# EAGLE design Rov3 - zasilanie silniki v4 (EAGLE 9.4.2)
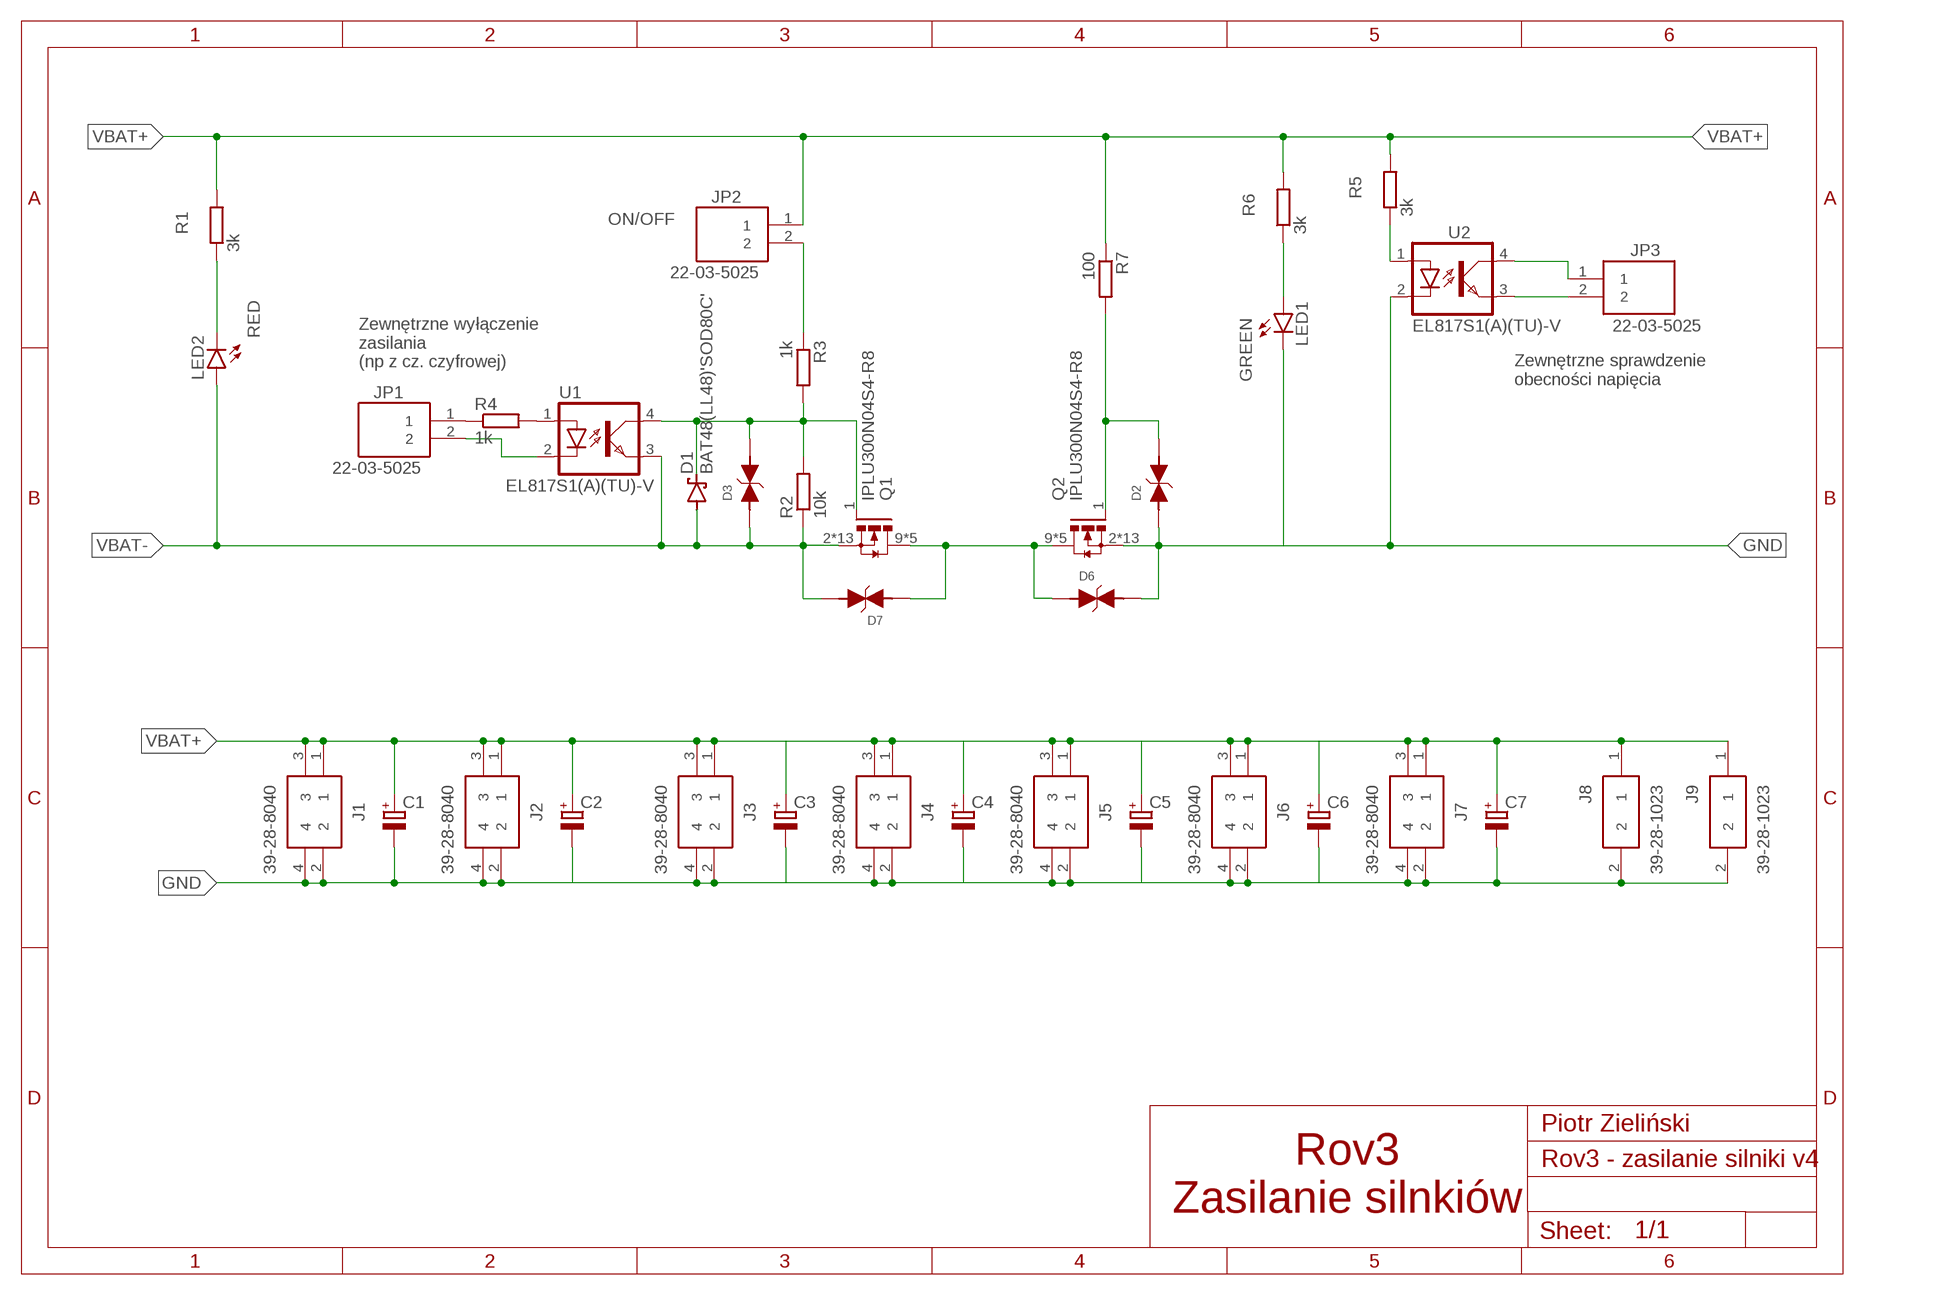
[diagram p0: schematic, sheet 1]

## Parts
C1  CPOL-EUE5-10.5  [E5-10,5]
C2  CPOL-EUE5-10.5  [E5-10,5]
C3  CPOL-EUE5-10.5  [E5-10,5]
C4  CPOL-EUE5-10.5  [E5-10,5]
C5  CPOL-EUE5-10.5  [E5-10,5]
C6  CPOL-EUE5-10.5  [E5-10,5]
C7  CPOL-EUE5-10.5  [E5-10,5]
D1  BAT48(LL48)'SOD80C'  [SOD80C]
D2  P6SMB20A_824501101  [VARTVSP_SMA/DO-214AC]
D3  P6SMB20A_824501101  [VARTVSP_SMA/DO-214AC]
D6  P6SMB20A_824501101  [VARTVSP_SMA/DO-214AC]
D7  P6SMB20A_824501101  [VARTVSP_SMA/DO-214AC]
J1  39-28-8040  [MOLEX_2X2_PCB_SOCKET]
J2  39-28-8040  [MOLEX_2X2_PCB_SOCKET]
J3  39-28-8040  [MOLEX_2X2_PCB_SOCKET]
J4  39-28-8040  [MOLEX_2X2_PCB_SOCKET]
J5  39-28-8040  [MOLEX_2X2_PCB_SOCKET]
J6  39-28-8040  [MOLEX_2X2_PCB_SOCKET]
J7  39-28-8040  [MOLEX_2X2_PCB_SOCKET]
J8  39-28-1023  [MOLEX_1X2_PCB_SOCKET]
J9  39-28-1023  [MOLEX_1X2_PCB_SOCKET]
JP1  22-03-5025  [2.50MM_MINI-SPOX_2PIN_PCB_SOCKET]
JP2  22-03-5025  [2.50MM_MINI-SPOX_2PIN_PCB_SOCKET]
JP3  22-03-5025  [2.50MM_MINI-SPOX_2PIN_PCB_SOCKET]
LED1  GREEN  LEDCHIP-LED0805  [CHIP-LED0805]
LED2  RED  LEDCHIP-LED0805  [CHIP-LED0805]
Q1  IPLU300N04S4-R8  [PG-HSOF-8-1]
Q2  IPLU300N04S4-R8  [PG-HSOF-8-1]
R1  3k  R-EU_R1206  [R1206]
R2  10k  R-EU_R1206  [R1206]
R3  1k  R-EU_R1206  [R1206]
R4  1k  R-EU_R1206  [R1206]
R5  3k  R-EU_R1206  [R1206]
R6  3k  R-EU_R1206  [R1206]
R7  100  R-EU_R1206  [R1206]
U1  EL817S1(A)(TU)-V  [SOIC254P1030X390-4N_EL817S1(A)(TU)-V]
U2  EL817S1(A)(TU)-V  [SOIC254P1030X390-4N_EL817S1(A)(TU)-V]

## Nets
GND: C1.- C2.- C3.- C4.- C5.- C6.- C7.- D2.1 D6.2 J1.2 J1.4 J2.2 J2.4 J3.2 J3.4 J4.2 J4.4 J5.2 J5.4 J6.2 J6.4 J7.2 J7.4 J8.2 J9.2 LED1.C Q2.2(S) Q2.3(S) Q2.4(S) Q2.5(S) Q2.6(S) Q2.7(S) Q2.8(S) Q2.10(S) Q2.11(S) Q2.12(S) Q2.13(S) Q2.14(S) Q2.15(S) U2.2(C)
N$1 [signal]: LED1.A R6.1
N$2: D6.1 D7.1 Q1.9(D) Q1.16(D) Q1.17(D) Q1.18(D) Q1.19(D) Q2.9(D) Q2.16(D) Q2.17(D) Q2.18(D) Q2.19(D)
N$3 [signal]: JP1.1 R4.1
N$4 [signal]: D1.C D3.2 Q1.1(G) R2.2 R3.2 U1.4(COL)
N$5 [signal]: JP1.2 U1.2(C)
N$6 [signal]: R4.2 U1.1(A)
N$7 [signal]: JP2.2 R3.1
N$8 [signal]: JP3.2 U2.3(EMIT)
N$9 [signal]: JP3.1 U2.4(COL)
N$10 [signal]: R5.1 U2.1(A)
N$11: LED2.C R1.1
N$15 [signal]: D2.2 Q2.1(G) R7.2
VBAT+: C1.+ C2.+ C3.+ C4.+ C5.+ C6.+ C7.+ J1.1 J1.3 J2.1 J2.3 J3.1 J3.3 J4.1 J4.3 J5.1 J5.3 J6.1 J6.3 J7.1 J7.3 J8.1 J9.1 JP2.1 R1.2 R5.2 R6.2 R7.1
VBAT-: D1.A D3.1 D7.2 LED2.A Q1.2(S) Q1.3(S) Q1.4(S) Q1.5(S) Q1.6(S) Q1.7(S) Q1.8(S) Q1.10(S) Q1.11(S) Q1.12(S) Q1.13(S) Q1.14(S) Q1.15(S) R2.1 U1.3(EMIT)

## Notes on the sheet
- ON/OFF
- Zewnętrzne wyłączenie
  zasilania
  (np z cz. czyfrowej)
- Zewnętrzne sprawdzenie 
  obecności napięcia
- Piotr Zieliński
- Rov3
  Zasilanie silnkiów

## Library data of the parts
C1-C7 = rcl:CPOL-EU: POLARIZED CAPACITOR, European symbol; SPICEPREFIX: C
D1 = SamacSys_Parts:BAT48(LL48)
D2 D3 D6 D7 = SamacSys_Parts:P6SMB20A: WE-TVSP Power TVS Diode <http://katalog.we-online.de/media/images/v2/WE-TVSP_600W-3000W_D0214AA_4C.jpg> Details see: http://katalog.we-online.de/en/pbs/WE-TVSP/824500101 2015 (C) Würth Elektronik
J1-J7 = SamacSys_Parts:39-28-8040: Molex Mini-Fit Jr 5566, 4.2mm Pitch, 4 Way, 2 Row Male PCB Header Source: Datasheet <https://componentsearchengine.com/Datasheets/1/39-28-8040.pdf>; DESCRIPTION: Molex Mini-Fit Jr 5566, 4.2mm Pitch, 4 Way, 2 Row Male PCB Header; HEIGHT: 13.1mm; MANUFACTURER_NAME: Molex; MANUFACTURER_PART_NUMBER: 39-28-8040; MOUSER_PART_NUMBER: 538-39-28-8040; MOUSER_PRICE-STOCK: https://www.mouser.com/Search/Refine.aspx?Keyword=538-39-28-8040
J8 J9 = SamacSys_Parts:39-28-1023: 2 way vertical PCB header,Mini-Fit Jr Molex MINI-FIT JR. Series, Series Number 5566, 4.2mm Pitch 2 Way 2 Row Straight PCB Header, Solder Termination, 9A Source: Datasheet <https://componentsearchengine.com/Datasheets/1/39-28-1023.pdf>; DESCRIPTION: 2 way vertical PCB header,Mini-Fit Jr Molex MINI-FIT JR. Series, Series Number 5566, 4.2mm Pitch 2 Way 2 Row Straight PCB Header, Solder Termination, 9A; HEIGHT: 13.1mm; MANUFACTURER_NAME: Molex; MANUFACTURER_PART_NUMBER: 39-28-1023; MOUSER_PART_NUMBER: 538-39-28-1023; MOUSER_PRICE-STOCK: https://www.mouser.com/Search/Refine.aspx?Keyword=538-39-28-1023
JP1-JP3 = SamacSys_Parts:22-03-5025: Header 2.5mm SPOX,WTB,vert, shrouded, 2w Molex SPOX Series, Series Number 5267, 2.5mm Pitch 2 Way 1 Row Straight PCB Header, Solder Termination Source: Datasheet <https://componentsearchengine.com/Datasheets/1/22-03-5025.pdf>; DESCRIPTION: Header 2.5mm SPOX,WTB,vert, shrouded, 2w Molex SPOX Series, Series Number 5267, 2.5mm Pitch 2 Way 1 Row Straight PCB Header, Solder Termination; HEIGHT: 5.9mm; MANUFACTURER_NAME: Molex; MANUFACTURER_PART_NUMBER: 22-03-5025; MOUSER_PART_NUMBER: 538-22-03-5025; MOUSER_PRICE-STOCK: https://www.mouser.com/Search/Refine.aspx?Keyword=538-22-03-5025
LED1 LED2 = led:LED: LED OSRAM: - CHIPLED LG R971, LG N971, LY N971, LG Q971, LY Q971, LO R971, LY R971 LH N974, LH R974 LS Q976, LO Q976, LY Q976 LO Q996 - Hyper CHIPLED LW Q18S LB Q993, LB Q99A, LB R99A - SideLED LS A670, LO A670, LY A670, LG A670, LP A670 LB A673, LV A673, LT A673, LW A673 LH A674 LY A675 LS A676, LA A676, LO A676, LY A676, LW A676 LS A679, LY A679, LG A679 - Hyper Micro SIDELED® LS Y876, LA Y876, LO Y876, LY Y876 LT Y87S - SmartLED LW L88C, LW L88S LB L89C, LB L89S, LG L890 LS L89K, LO L89K, LY L89K LS L896, LA L896, LO L896, LY L896 - TOPLED LS T670, LO T670, LY T670, LG T670, LP T670 LSG T670, LSP T670, LSY T670, LOP T670, LYG T670 LG T671, LOG T671, LSG T671 LB T673, LV T673, LT T673, LW T673 LH T674 LS T676, LA T676, LO T676, LY T676, LB T676, LH T676, LSB T676, LW T676 LB T67C, LV T67C, LT T67C, LS T67K, LO T67K, LY T67K, LW E67C LS E67B, LA E67B, LO E67B, LY E67B, LB E67C, LV E67C, LT E67C LW T67C LS T679, LY T679, LG T679 LS T770, LO T770, LY T770, LG T770, LP T770 LB T773, LV T773, LT T773, LW T773 LH T774 LS E675, LA E675, LY E675, LS T675 LS T776, LA T776, LO T776, LY T776, LB T776 LHGB T686 LT T68C, LB T68C - Hyper Mini TOPLED® LB M676 - Mini TOPLED Santana® LG M470 LS M47K, LO M47K, LY M47K Source: http://www.osram.convergy.de LUXEON: - LUMILED® LXK2-PW12-R00, LXK2-PW12-S00, LXK2-PW14-U00, LXK2-PW14-V00 LXK2-PM12-R00, LXK2-PM12-S00, LXK2-PM14-U00 LXK2-PE12-Q00, LXK2-PE12-R00, LXK2-PE12-S00, LXK2-PE14-T00, LXK2-PE14-U00 LXK2-PB12-K00, LXK2-PB12-L00, LXK2-PB12-M00, LXK2-PB14-N00, LXK2-PB14-P00, LXK2-PB14-Q00 LXK2-PR12-L00, LXK2-PR12-M00, LXK2-PR14-Q00, LXK2-PR14-R00 LXK2-PD12-Q00, LXK2-PD12-R00, LXK2-PD12-S00 LXK2-PH12-R00, LXK2-PH12-S00 LXK2-PL12-P00, LXK2-PL12-Q00, LXK2-PL12-R00 Source: www.luxeon.com KINGBRIGHT: KA-3528ASYC Source: www.kingbright.com
Q1 Q2 = SamacSys_Parts:IPLU300N04S4-R8: MOSFET N-CHANNEL 30/40V Source: Datasheet <https://componentsearchengine.com/Datasheets/1/IPLU300N04S4-R8.pdf>; DESCRIPTION: MOSFET N-CHANNEL 30/40V; HEIGHT: mm; MANUFACTURER_NAME: Infineon; MANUFACTURER_PART_NUMBER: IPLU300N04S4-R8; MOUSER_PART_NUMBER: 726-IPLU300N04S4-R8; MOUSER_PRICE-STOCK: https://www.mouser.com/Search/Refine.aspx?Keyword=726-IPLU300N04S4-R8
R1-R7 = rcl:R-EU_: RESISTOR, European symbol; SPICEPREFIX: R
U1 U2 = SamacSys_Parts:EL817S1(A)(TU)-V: Optoisoltr 5kv Transistor 4-Smd; AVAILABILITY: Unavailable; DESCRIPTION: Optoisoltr 5kv Transistor 4-Smd; MF: Everlight Electronics; MP: EL817S1_A__TU_-V; PACKAGE: SMD-4 Everlight Electronics; PRICE: None

## Net classes
0 supply: width 0.5 mm, clearance 0.3 mm
1 signal: width 0.4 mm, drill 0.4 mm, clearance 0.3 mm

## Board
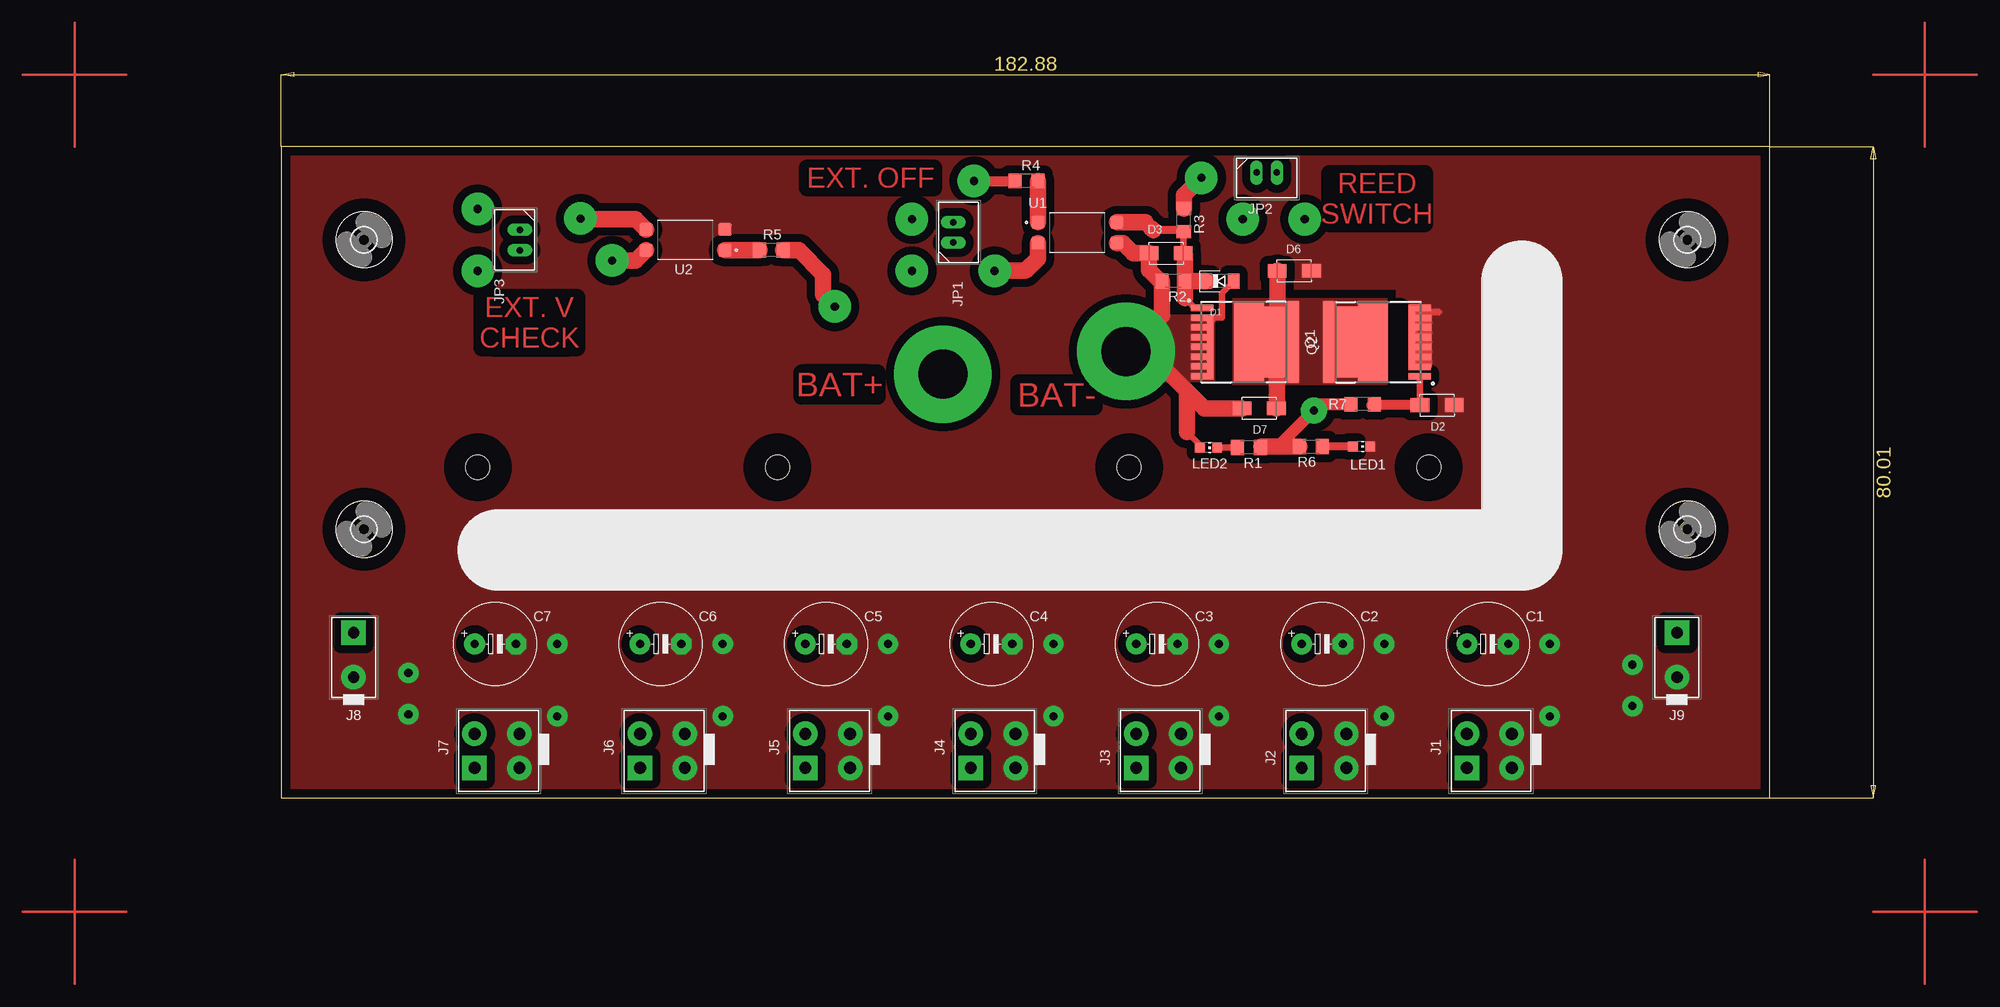
[diagram p1: board, top side]
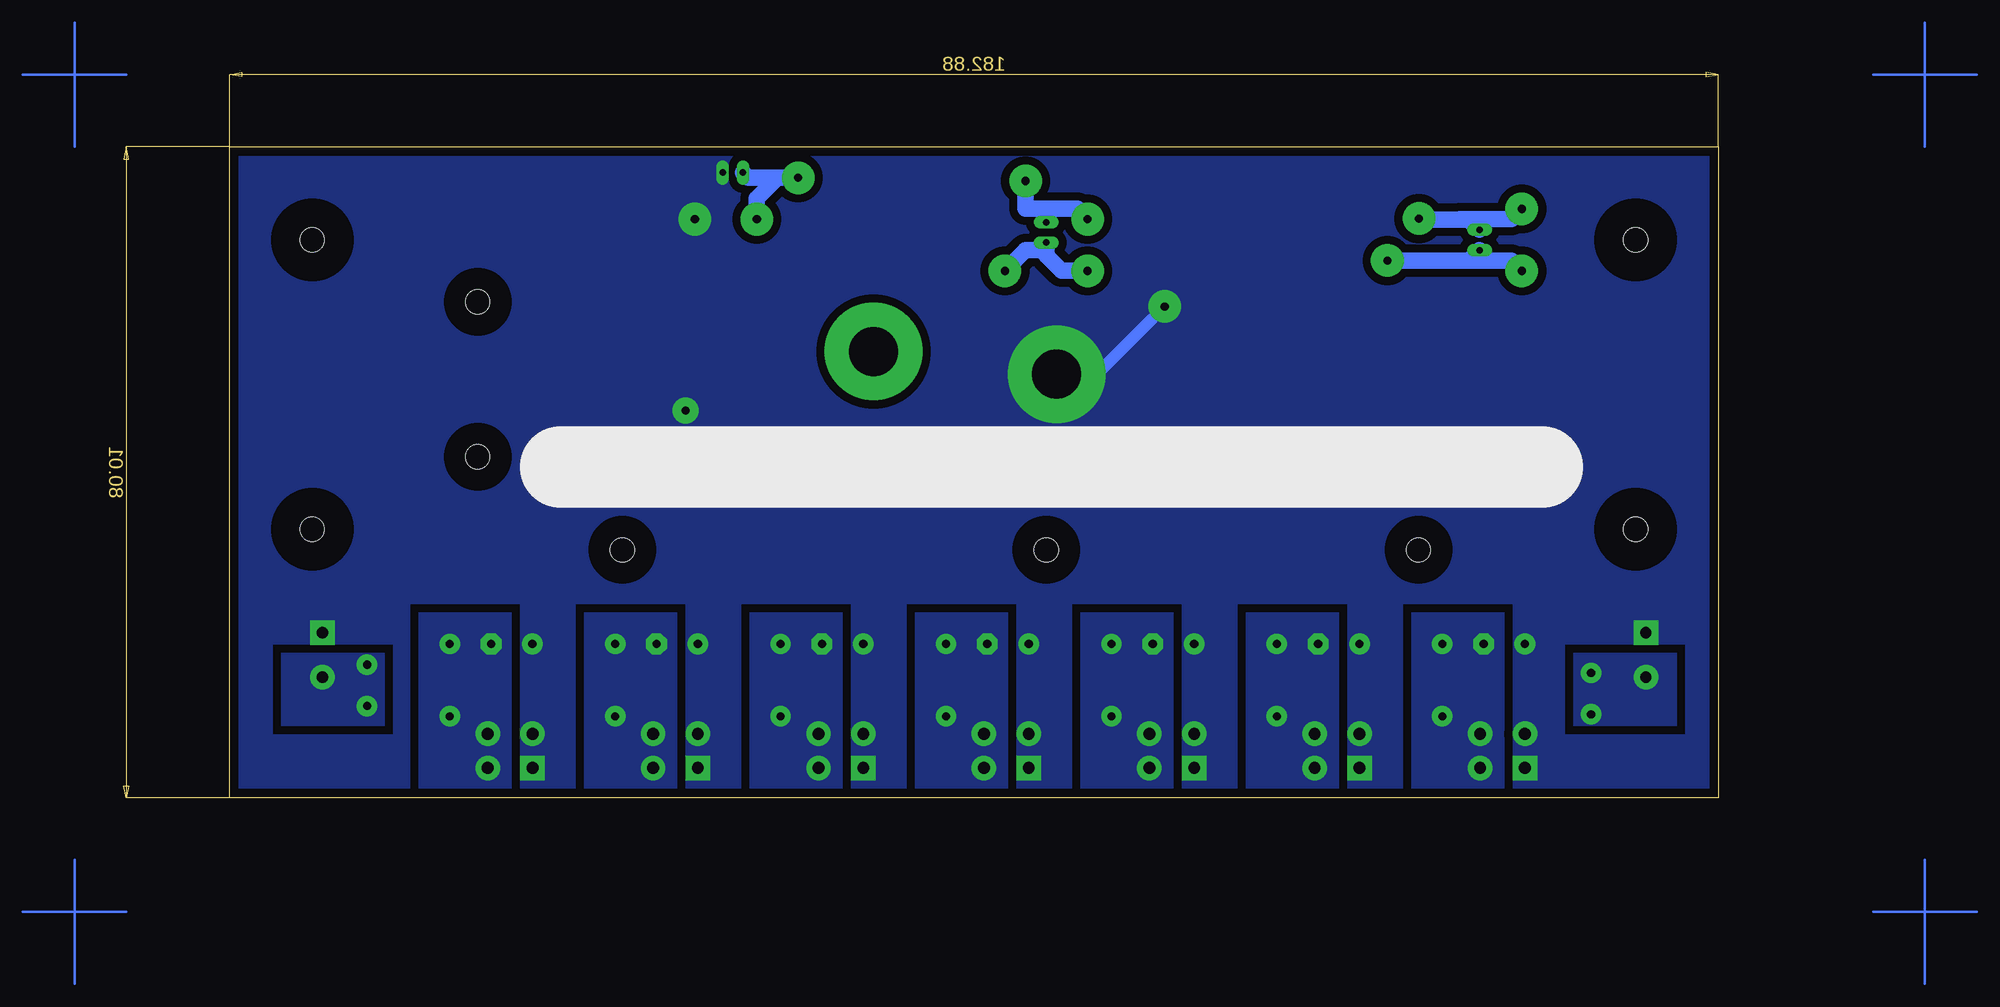
[diagram p2: board, bottom side, seen from below]

Size 195.88 x 89.2 mm. Coordinates in mm from the lower left corner, seen from the top.
Outline: 0,0 182.88,0 182.88,80.01 0,80.01 0,0
Copper layers (1*16): Top 0.035mm / dielectric 1.5mm / Bottom 0.035mm
Design rules "default *": minimum track width 6mil, minimum drill 0.35mm, track to track 6mil, track to pad 6mil, pad to pad 6mil, via to via 6mil, smd to smd 6mil, copper to edge 40mil, drill to drill 6mil, minimum pad ring 10mil, minimum via ring 8mil, stop-mask expansion 4mil, vias tented up to drill 0mil, thermal gap 10mil
Holes 3 mm at 36.83,30.48 82.55,30.48 134.62,30.48 140.97,40.64 152.4,41.91 104.14,40.64 60.96,40.64 24.13,40.64 152.4,60.96
tRestrict: area 136.4,50.9 to 137.5,60.5; area 139.7,39.4 to 142.2,41.9; area 102.9,39.4 to 105.4,41.9; area 59.7,39.4 to 62.2,41.9; area 22.9,39.4 to 25.4,41.9; area 66,74.9 to 78.7,77.5; area 26,55.2 to 35.2,61.5; area 64.4,49.4 to 71.9,52.3
bRestrict: area 133.3,29.2 to 135.9,31.8; area 151.1,40.6 to 153.7,43.2; area 151.1,59.7 to 153.7,62.2; area 81.3,29.2 to 83.8,31.8; area 35.6,29.2 to 38.1,31.8

### Footprints (pad centres in the part's own frame; a part is rotated, then mirrored left to right if it is on the bottom)
E5-10,5 = drill 1.016 pad 2.54: + -2.54,0 | drill 1.016 pad 2.54 octagon: - 2.54,0
SOD80C = smd 1.4 x 1.8: A 1.7,0; C -1.7,0
VARTVSP_SMA/DO-214AC = smd 2.3 x 1.7: 1 -2.1,0; 2 2.1,0
MOLEX_2X2_PCB_SOCKET = drill 1.45 pad 3 square: 1 -2.54,2.54 | drill 1.45 pad 3: 2 -2.54,-2.96; 3 1.66,2.54; 4 1.66,-2.96
MOLEX_1X2_PCB_SOCKET = drill 1.4 pad 3 square: 1 0,2.54 | drill 1.4 pad 3: 2 0,-2.96
2.50MM_MINI-SPOX_2PIN_PCB_SOCKET = drill 0.8 pad 1.524 long: 1 1.27,0; 2 -1.23,0
CHIP-LED0805 = smd 1.2 x 1.2: A 0,-1.05; C 0,1.05
PG-HSOF-8-1 = smd 0.8 x 2.8: 1 -4.33,-4.982; 2 -3.13,-4.982; 3 -1.93,-4.982; 4 -0.73,-4.982; 5 0.47,-4.982; 6 1.67,-4.982; 7 2.87,-4.982; 8 4.07,-4.982 | smd 8.7 x 8: 9 -0.13,2.918 | smd 0.5 x 0.8: 10 -2.53,-3.982; 11 -1.33,-3.982; 12 -0.13,-3.982; 13 1.07,-3.982; 14 2.27,-3.982; 15 3.47,-3.982 | smd 0.7 x 3.7: 16 -4.83,0.768; 17 4.57,0.768 | smd 0.7 x 1.4: 18 -4.83,6.218; 19 4.57,6.218
R1206 = smd 1.6 x 1.803: 1 -1.422,0; 2 1.422,0
SOIC254P1030X390-4N_EL817S1(A)(TU)-V = smd 1.664 x 1.546: 1 -4.85,1.27; 2 -4.85,-1.27; 3 4.85,-1.27; 4 4.85,1.27
3,0 = hole 3: 0,0

### Placement (x,y rotation side)
C1  148.21,18.92 0 top
C2  127.89,18.92 0 top
C3  107.57,18.92 0 top
C4  87.25,18.92 0 top
C5  66.93,18.92 0 top
C6  46.61,18.92 0 top
C7  26.29,18.92 0 top
D1  115.32,63.5 0 top
D2  141.99,48.26 180 top
D3  108.71,66.93 0 top
D6  124.46,64.77 0 top
D7  120.14,47.88 180 top
J1  148.21,6.22 90 top
J2  127.89,6.22 90 top
J3  107.57,6.22 90 top
J4  87.25,6.22 90 top
J5  66.93,6.22 90 top
J6  46.61,6.22 90 top
J7  26.29,6.22 90 top
J8  8.89,17.78 0 top
J9  171.45,17.78 0 top
JP1  82.55,69.47 90 top
JP2  121.03,76.83 0 top
JP3  29.34,68.58 270 top
LED1  132.72,43.18 270 top
LED2  113.92,43.05 270 top
Q1  118.11,55.88 270 top
Q2  134.87,56.13 90 top
R1  118.87,43.05 0 top
R2  109.6,63.5 0 top
R3  110.87,70.99 270 top
R4  91.57,75.82 0 top
R5  60.2,67.31 0 top
R6  126.49,43.18 180 top
R7  132.84,48.39 0 top
U1  97.79,69.47 0 top
U2  49.66,68.58 180 top
U$1  [3,0]  10.16,33.02 0 top
U$2  [3,0]  10.16,68.58 0 top
U$3  [3,0]  172.72,68.58 0 top
U$4  [3,0]  172.72,33.02 0 top

### Tracks (layer width: path | path; a pad name or v marks a point on that pad's centre or on a via)
GND  (via drill 1 pad 2.5)
  Top 0.8: Q2.8 139.26,59.6 | Q2.15 139.26,59.6 | 139.26,59.6 Q2.7 Q2.6 | Q2.6 139.26,58.4 Q2.14 | Q2.6 139.46,57.8 Q2.13 139.26,57.2 Q2.5 139.26,56 | 139.26,56 Q2.12 | 139.26,56 Q2.4 139.26,54.8 | 139.26,54.8 Q2.11 | 139.26,54.8 Q2.3 139.26,53.6 Q2.10 139.46,53 Q2.2 140.34,53.48 140.34,53.72 | Q2.8 140.97,59.09 | 140.97,59.09 140.97,53.09 140.34,53.72 | 140.34,53.72 140.34,59.82 | Q2.8 140.37,59.69 140.97,59.69 | 140.97,59.69 142.24,59.69 | 140.97,59.69 140.97,59.09
  other vias: 155.83,18.92 155.83,10.03 135.51,18.92 135.51,10.03 115.19,10.03 115.19,18.92 94.87,18.92 94.87,10.03 74.55,18.92 74.55,10.03 54.23,18.92 54.23,10.03 33.91,18.92 33.91,10.03 15.62,10.29 15.62,15.37 165.99,16.38 165.99,11.3
  pour Top (isolate 1, rank 3, no thermals): 0,0 182.88,0 182.88,80.01 0,80.01
  pour Bottom (isolate 1, no thermals): 127.89,1.14 127.89,22.73 139.32,22.73 139.32,1.14
  pour Bottom (isolate 1, no thermals): 107.57,1.14 107.57,22.73 119,22.73 119,1.14
  pour Bottom (isolate 1, no thermals): 148.21,1.14 148.21,22.73 159.64,22.73 159.64,1.14
  pour Bottom (isolate 1, no thermals): 87.25,1.14 87.25,22.73 98.68,22.73 98.68,1.14
  pour Bottom (isolate 1, no thermals): 66.93,1.14 66.93,22.73 78.36,22.73 78.36,1.14
  pour Bottom (isolate 1, no thermals): 46.61,1.14 46.61,22.73 58.04,22.73 58.04,1.14
  pour Bottom (isolate 1, no thermals): 26.29,1.14 26.29,22.73 37.72,22.73 37.72,1.14
  pour Bottom (no thermals): 17.78,8.89 5.08,8.89 5.08,17.78 17.78,17.78
  pour Bottom (no thermals): 163.83,17.78 176.53,17.78 176.53,8.89 163.83,8.89
N$1
  Top 1: LED1.A R6.1
N$2
  Top 1: 120.65,55.88 120.9,55.88 Q1.9 | 120.65,55.88 120.65,52.87 122.29,51.23 | 122.36,57.59 120.65,55.88
  Top 2: 122.29,51.23 122.29,47.93 D7.1 | D6.1 122.36,57.59
  pour Top (no thermals): 135.89,61.34 116.84,61.34 116.84,50.8 135.89,50.8
N$3  (via drill 1 pad 4)
  Top 1.2: v85.09,75.82 R4.1
  Bottom 1: 85.09,72.39 84.2,72.39 JP1.1 80.9,72.39 80.01,72.39
  Bottom 2: v85.09,75.82 85.09,72.39 80.01,72.39 78.74,72.39 v77.47,71.12
N$4
  Top 0.5: D3.2 111.06,66.68 111.31,66.93 | R3.2 110.81,69.98
  Top 0.8: Q1.1 112.26,60.21
  Top 0.813: 112.26,60.21 111.06,61.41 | 110.81,69.98 D3.2 110.86,66.98
  Top 1: 111.06,61.41 111.02,61.44 | 111.02,66.72 D3.2 | R3.2 110.65,69.79 107.12,69.79 | 106.87,70.04 106.17,70.74
  Top 2: 107.12,69.79 106.87,70.04 | 111.02,61.44 R2.2 | R2.2 111.02,66.72 | R2.2 D1.C | 106.17,70.74 U1.4
N$5  (via drill 1 pad 4)
  Top 2: U1.2 92.94,66.27 91.44,64.77 v87.63,64.77
  Bottom 1: JP1.2 82.55,67.31
  Bottom 2: v77.47,64.77 80.69,64.77 82.55,66.63 82.55,67.31 85.09,67.31 v87.63,64.77
N$6
  Top 2: R4.2 92.99,70.79 U1.1
N$7  (via drill 1 pad 4)
  Top 2: R3.1 110.87,74.04 v113.03,76.2
  Bottom 2: v113.03,76.2 115.57,76.2 | 115.57,76.2 119.17,76.2 JP2.2 | 115.57,76.2 118.11,73.66 v118.11,71.12
N$8  (via drill 1 pad 4)
  Top 0.5: JP3.2 29.38,69.85
  Top 0.813: 36.76,71.12 v36.76,71.19
  Top 2: U2.3 43.54,71.12 36.76,71.12
  Bottom 0.813: v36.76,71.19 36.76,71.08
  Bottom 2: 36.76,71.08 31.75,71.08 | 31.75,71.08 30.61,71.08 JP3.2 | 31.75,71.08 31.71,71.12 25.4,71.12 v24.13,72.39
N$9  (via drill 1 pad 4)
  Top 2: U2.4 43.54,66.04 v40.64,66.04
  Bottom 2: v40.64,66.04 30.61,66.04 | JP3.1 30.61,66.04 | 30.61,66.04 25.4,66.04 v24.13,64.77
N$10
  Top 2: U2.1 R5.1
N$11
  Top 0.813: R1.1 LED2.C
N$12
  Top 0.3: -25.4,95.25 -25.4,80.01
N$13
  Top 0.3: -31.75,88.9 -19.05,88.9
N$14
  Top 0.3: 201.93,95.25 201.93,80.01
N$15
  Top 0.8: Q2.1 139.86,48.29
  Top 1: 139.86,48.29 D2.2 | 133.92,48.26 R7.2
  Top 1.2: D2.2 133.92,48.26
N$16
  Top 0.3: 195.58,88.9 208.28,88.9
N$17
  Bottom 0.3: 201.93,95.25 201.93,80.01
N$18
  Bottom 0.3: 195.58,88.9 208.28,88.9
N$19
  Top 0.3: -25.4,-7.62 -25.4,-22.86
N$20
  Top 0.3: -31.75,-13.97 -19.05,-13.97
N$21
  Bottom 0.3: -25.4,95.25 -25.4,80.01
N$22
  Bottom 0.3: -31.75,88.9 -19.05,88.9
N$23
  Bottom 0.3: -25.4,-7.62 -25.4,-22.86
N$24
  Bottom 0.3: -31.75,-13.97 -19.05,-13.97
N$25
  Top 0.3: 201.93,-7.62 201.93,-22.86
N$26
  Top 0.3: 195.58,-13.97 208.28,-13.97
N$27
  Bottom 0.3: 201.93,-7.62 201.93,-22.86
N$28
  Bottom 0.3: 195.58,-13.97 208.28,-13.97
VBAT+  (via drill 1 pad 3.2, 1 pad 4, 6 pad 12)
  Top 1: R1.2 119.95,43.18 | 67.94,60.45 v68.01,60.39 | v126.87,47.62 127.64,48.39 | 122.3,43.05 R1.2 | R1.2 120.42,43.18
  Top 1.5: 127.64,48.39 R7.1 | v126.87,47.62 122.3,43.05
  Top 2: R6.2 120.42,43.18 | v68.01,60.39 66.57,61.82 66.57,64.28 63.63,67.31 R5.2
  Bottom 1.5: v68.01,60.39 76.33,52.07 v81.28,52.07
  other vias: 125.73,71.12
  pour Bottom (isolate 1, rank 2, no thermals): 0,0 0,80.01 182.88,80.01 182.88,0
VBAT-  (via drill 6 pad 12)
  Top 0.8: 115.57,59.01 114.71,59.01
  Top 0.813: 111.25,44.96 112.87,43.34 LED2.A | v103.76,54.86 106.17,54.86 111.25,49.78 | 103.76,53.34 v103.76,54.86 | v103.76,54.86 103.76,56.64 | D1.A 115.57,62.05 115.57,59.01 | 114.71,59.01 114.13,58.43 Q1.10
  Top 1: 107.95,53.34 103.76,53.34 | 108.18,59.28 v103.76,54.86 | R2.1 107.95,63.5
  Top 2: 111.25,49.78 111.25,44.96 | D7.2 113.41,47.88 107.95,53.34 | R2.1 108.18,59.28 | U1.3 103.38,68.2 104.65,66.93 D3.1 106.61,64.84 107.95,63.5
  pour Top (rank 2, no thermals): 114.68,59.31 103.25,59.31 103.25,51.18 114.68,51.18

### Text on the board
Top: EXT. OFF | REED / SWITCH | EXT. V / CHECK | BAT+ | BAT-